# EasyEDA Pro project ProPrj_PocketEPD_2025-11-28.epro

# Schematic Main_Schematic
Board Name: PockEINK; Create Date: 2025-10-21; Page Name: P1; Project Name: PocketEPD; Schematic Name: Main_Schematic; Update Date: 2025-11-20; Company: AtomicBool; Page Size: A4; Version: V1.0
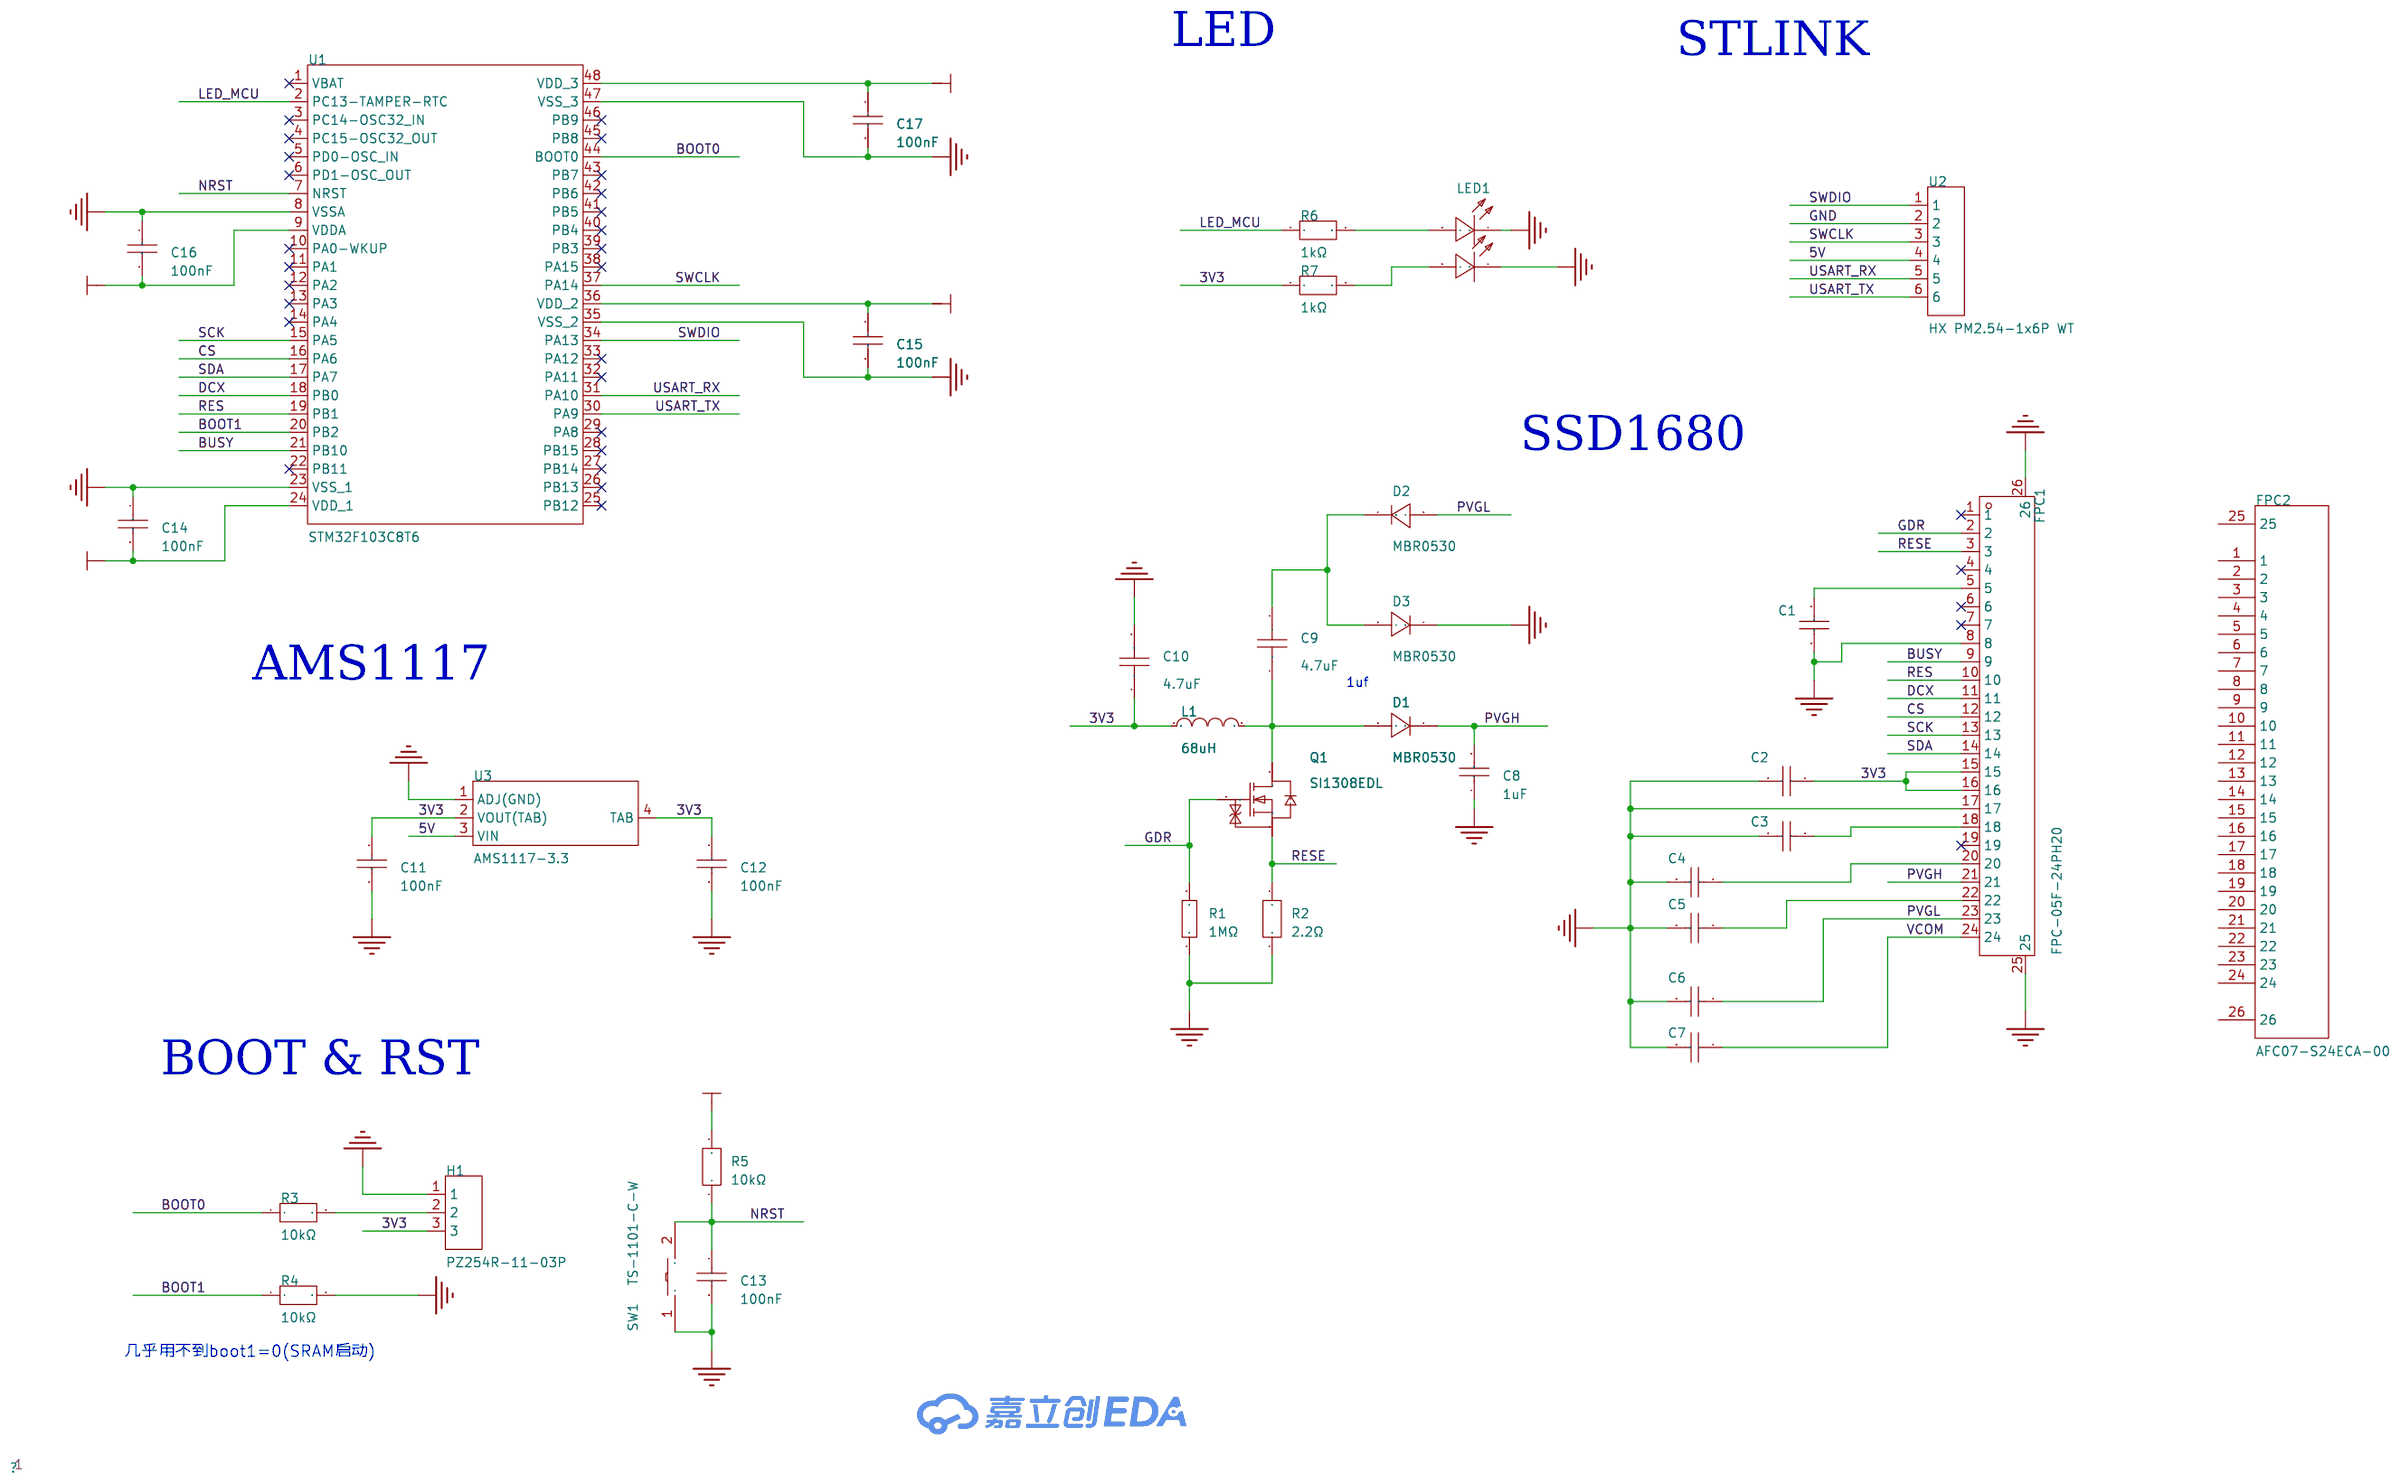
[diagram p0: schematic sheet]

## Parts
C1  1uF  [C1206]
C2  1uF  [C1206]
C3  1uF  [C1206]
C4  1uF  [C1206]
C5  1uF  [C1206]
C6  1uF  [C1206]
C7  1uF  [C1206]
C8  1uF  [C1206]
C9  4.7uF  [C1206]
C10  4.7uF  [C1206]
C11  100nF  [C1206]
C12  100nF  [C1206]
C13  100nF  [C1206]
C14  100nF  [C1206]
C15  100nF  [C1206]
C16  100nF  [C1206]
C17  100nF  [C1206]
D1  MBR0530  [SOD-123_L2.8-W1.8-LS3.7-RD]
D2  MBR0530  [SOD-123_L2.8-W1.8-LS3.7-RD]
D3  MBR0530  [SOD-123_L2.8-W1.8-LS3.7-RD]
FPC1  FPC-05F-24PH20  [FPC-SMD_24P-P0.50_FPC-05F-24PH20]
FPC2  AFC07-S24ECA-00  [FPC-SMD_AFC07-S24ECA-00]
H1  PZ254R-11-03P  [HDR-TH_3P-P2.54-H-M-W10.4]
L1  68uH  [IND-SMD_L4.0-W4.0_FNR40XXS]
LED1  TJ-S3227SW1TCGLC2R6B-A5  [LED-SMD_4P-L3.2-W2.7_PD15-22C]
Q1  SI1308EDL  [SOT-323-3_L2.0-W1.3-P1.30-LS2.1-BR]
R1  1MΩ  [R1206]
R2  2.2Ω  [R1206]
R3  10kΩ  [R1206]
R4  10kΩ  [R1206]
R5  10kΩ  [R1206]
R6  1kΩ  [R1206]
R7  1kΩ  [R1206]
SW1  TS-1101-C-W  [SW-SMD_L6.0-W3.3-LS8.0]
U1  STM32F103C8T6  [LQFP-48_L7.0-W7.0-P0.50-LS9.0-BL]
U2  HX PM2.54-1x6P WT  [HDR-SMD_6P-P2.54-H-F-W11.7]
U3  AMS1117-3.3  [SOT-223-4_L6.5-W3.5-P2.30-LS7.0-BR]

## Library data of the parts
C1-C8 = CL31B105KAHNNNE: 容值:1uF;精度:±10%;额定电压:25V;温度系数:X7R;; LCSC Part Name: 1uF ±10% 25V; Supplier Part: C28322; Manufacturer: SAMSUNG(三星); Supplier Footprint: 1206; JLCPCB Part Class: 扩展库; Datasheet: https://item.szlcsc.com/datasheet/CL31B105KAHNNNE/29073.html; Supplier: LCSC; Tolerance: ±10%; Voltage Rating: 25V; Temperature Coefficient: X7R
C9 C10 = 1206B475K250NT: 容值:4.7uF;精度:±10%;额定电压:25V;温度系数:X7R;; LCSC Part Name: 4.7uF ±10% 25V; Supplier Part: C132148; Manufacturer: FH(风华); Supplier Footprint: 1206; JLCPCB Part Class: 扩展库; Datasheet: https://item.szlcsc.com/datasheet/1206B475K250NT/143447.html; Supplier: LCSC; Tolerance: ±10%; Voltage Rating: 25V; Temperature Coefficient: X7R
C11-C17 = CL31B104KCFNNNE: 容值:100nF;精度:±10%;额定电压:100V;温度系数:X7R;; LCSC Part Name: 100nF ±10% 100V; Supplier Part: C1945; Manufacturer: SAMSUNG(三星); Supplier Footprint: 1206; JLCPCB Part Class: 扩展库; Datasheet: https://item.szlcsc.com/datasheet/CL31B104KCFNNNE/2297.html; Supplier: LCSC; Tolerance: ±10%; Voltage Rating: 100V; Temperature Coefficient: X7R
D1-D3 = MBR0530_C77336: 二极管配置:-;正向压降(Vf):550mV@500mA;直流反向耐压(Vr):30V;整流电流:500mA;; LCSC Part Name: 电压:30V 电流:500mA; Supplier Part: C77336; Manufacturer: CJ(江苏长电/长晶); Supplier Footprint: SOD-123; JLCPCB Part Class: 扩展库; Datasheet: https://item.szlcsc.com/datasheet/MBR0530/78464.html; Supplier: LCSC; Voltage - Forward(Vf@If): 550mV@500mA; Voltage - DC Reverse(Vr): 30V; Current - Rectified: 500mA; Reverse Leakage Current (Ir): 80uA@30V; Non-Repetitive Peak Forward Surge Current: 5.5A
FPC1 = FPC-05F-24PH20: 锁定特性:翻盖式;触点类型:卧贴;触点数量:24P;间距:0.5mm;安装方式:下接;工作温度:-25℃~+85℃;; LCSC Part Name: 翻盖式 卧贴 P数:24P 间距:0.5mm; Supplier Part: C2856805; Manufacturer: XUNPU(讯普); Supplier Footprint: SMD,P=0.5mm,卧贴; JLCPCB Part Class: 扩展库; Datasheet: https://item.szlcsc.com/datasheet/FPC-05F-24PH20/3056903.html; Supplier: LCSC; Locking Feature: 翻盖式; Contact Type: 卧贴; Number of Contacts: 24P; Pitch: 0.5mm; Mounting Type: 下接; FFC, FCB Thickness: 0.3mm; Height Above Board: 2mm; Contact Material: 磷青铜; Contact Plating: 锡; Operating Temperature: -25℃~+85℃; Rated Voltage (Max): 50V; Current Rating (Max): 500mA
FPC2 = AFC07-S24ECA-00: 锁定特性:抽屉式;触点类型:上接;触点数量:24P;间距:0.5mm;安装类型:卧贴;; LCSC Part Name: 间距:0.5mm P数:24P 抽屉式 上接; Supplier Part: C262643; Manufacturer: JS(钜硕电子); Supplier Footprint: SMD,P=0.5mm,卧贴; JLCPCB Part Class: 扩展库; Datasheet: https://atta.szlcsc.com/upload/public/pdf/source/20190726/C11082_A2E7B12387019CE4314BB5199EE0FDF4.pdf; Supplier: LCSC; Locking Feature: 抽屉式; Contact Type: 上接; Number of Contacts: 24P; Pitch: 0.5mm; Mounting Type: 卧贴; FFC, FCB Thickness: 0.3mm; Height Above Board: 2mm
H1 = PZ254R-11-03P: 插针结构:1x3P;间距:2.54mm;行距:-;圆针/方针:方针;安装方式:弯插;排数:单排;总PIN位数:3P;额定电流:-;额定电压:-;配合针长度:6mm;塑高:2.5mm;触头材质:黄铜;触头镀层:-;工作温度:-40℃~+105℃;颜色:黑色;; LCSC Part Name: 1x3P 间距:2.54mm 方针 弯插; Supplier Part: C492411; Manufacturer: XFCN(兴飞); Supplier Footprint: 弯插,P=2.54mm; JLCPCB Part Class: 扩展库; Datasheet: https://item.szlcsc.com/datasheet/PZ254R-11-03P/502967.html; Supplier: LCSC; Pin Structure: 1x3P; Pitch: 2.54mm; Circluar Pins/Square Pins: 方针; Mounting Type: 弯插; Number of Rows: 单排; Number of Pins: 3P; Length of Mating Pin: 6mm; Insulation Height: 2.5mm; Contact Material: 黄铜; Operating Temperature: -40℃~+105℃; Color: 黑色
L1 = FNR4020S680MT: 电感值:68uH;精度:±20%;额定电流:500mA;饱和电流(Isat):670mA;类型:磁胶屏蔽绕线合金电感;; LCSC Part Name: 68uH ±20% 670mA; Supplier Part: C167847; Manufacturer: cjiang(长江微电); Supplier Footprint: SMD,4x4mm; JLCPCB Part Class: 扩展库; Datasheet: https://atta.szlcsc.com/upload/public/pdf/source/20190327/C167925_9EFF0AABC4CA629C2CC95961DBF7D39D.pdf; Supplier: LCSC; Tolerance: ±20%; Current Rating: 500mA; Current - Saturation(Isat): 670mA; DC Resistance(DCR): 1.38Ω; Type: 磁胶屏蔽绕线合金电感
LED1 = TJ-S3227SW1TCGLC2R6B-A5: 发光颜色:红色,蓝色;正向压降(Vf):1.8V~2.4V；2.8V~3.4V;功率:108mW；72mW;正向电流:20mA;波长:620nm~630nm；460nm~470nm;二极管配置:-;透镜颜色:无色透明透镜;色温:-;发光强度:200mcd;发光角度:120°;载带方式:-;工作温度:-40℃~+80℃;; LCSC Part Name: 红灯,蓝灯; Supplier Part: C601676; Manufacturer: TOGIALED(统佳); Supplier Footprint: 1210; JLCPCB Part Class: 扩展库; Datasheet: https://item.szlcsc.com/datasheet/TJ-S3227SW1TCGLC2R6B-A5/631034.html; Supplier: LCSC; Illumination Color: 红色,蓝色; Voltage - Forward(Vf): 1.8V~2.4V；2.8V~3.4V; Power(Watts): 108mW；72mW; Forward Current: 20mA; Wavelength - Dominant: 620nm~630nm；460nm~470nm; Peak Wavelength: 460nm；630nm; Lens Color: 无色透明透镜; Luminous Intensity: 200mcd; Viewing Angle: 120°; Operating Temperature: -40℃~+80℃
Q1 = SI1308EDL: 漏源电压(Vdss):30V;连续漏极电流(Id):1.4A;导通电阻(RDS(on)):150mΩ@4.5V,0.5A;耗散功率(Pd):360mW;阈值电压(Vgs(th)):1.5V;; LCSC Part Name: 耐压:30V 电流:1.4A; Supplier Part: C7603347; Manufacturer: TECH PUBLIC(台舟); Supplier Footprint: SOT-323; JLCPCB Part Class: 扩展库; Datasheet: https://item.szlcsc.com/datasheet/SI1308EDL/8728853.html; Supplier: LCSC; Drain to Source Voltage: 30V; Current - Continuous Drain(Id): 1.4A; RDS(on): 150mΩ@4.5V,0.5A; Pd - Power Dissipation: 360mW; Gate Threshold Voltage (Vgs(th)): 1.5V; Input Capacitance(Ciss): 146pF@15V; Reverse Transfer Capacitance (Crss@Vds): 14.8pF@15V; Operating Temperature: -55℃~+150℃
R1 = FRC1206J105 TS: 电阻类型:厚膜电阻;阻值:1MΩ;精度:±5%;功率:250mW;工作电压:200V;温度系数:±100ppm/℃;; LCSC Part Name: 1MΩ ±5% 250mW 厚膜电阻; Supplier Part: C2907441; Manufacturer: FOJAN(富捷); Supplier Footprint: 1206; JLCPCB Part Class: 扩展库; Supplier: LCSC; Type: 厚膜电阻; Tolerance: ±5%; Power(Watts): 250mW; Voltage-Supply(Max): 200V; Temperature Coefficient: ±100ppm/℃; Operating Temperature: -55℃~+155℃
R2 = FRC1206J2R2 TS: 电阻类型:厚膜电阻;阻值:2.2Ω;精度:±5%;功率:250mW;工作电压:200V;温度系数:±200ppm/℃;; LCSC Part Name: 2.2Ω ±5% 250mW 厚膜电阻; Supplier Part: C2907445; Manufacturer: FOJAN(富捷); Supplier Footprint: 1206; JLCPCB Part Class: 扩展库; Supplier: LCSC; Type: 厚膜电阻; Tolerance: ±5%; Power(Watts): 250mW; Voltage-Supply(Max): 200V; Temperature Coefficient: ±200ppm/℃; Operating Temperature: -55℃~+155℃
R3-R5 = FRC1206J103 TS: 电阻类型:厚膜电阻;阻值:10kΩ;精度:±5%;功率:250mW;工作电压:200V;温度系数:±100ppm/℃;; LCSC Part Name: 10kΩ ±5% 250mW 厚膜电阻; Supplier Part: C2907423; Manufacturer: FOJAN(富捷); Supplier Footprint: 1206; JLCPCB Part Class: 扩展库; Supplier: LCSC; Type: 厚膜电阻; Tolerance: ±5%; Power(Watts): 250mW; Voltage-Supply(Max): 200V; Temperature Coefficient: ±100ppm/℃; Operating Temperature: -55℃~+155℃
R6 R7 = FRC1206J102 TS: 电阻类型:厚膜电阻;阻值:1kΩ;精度:±5%;功率:250mW;工作电压:200V;温度系数:±100ppm/℃;; LCSC Part Name: 1kΩ ±5% 250mW 厚膜电阻; Supplier Part: C2907440; Manufacturer: FOJAN(富捷); Supplier Footprint: 1206; JLCPCB Part Class: 扩展库; Supplier: LCSC; Type: 厚膜电阻; Tolerance: ±5%; Power(Watts): 250mW; Voltage-Supply(Max): 200V; Temperature Coefficient: ±100ppm/℃; Operating Temperature: -55℃~+155℃
SW1 = TS-1101-C-W: 电路结构:单刀单掷;按钮形状:矩形按钮;作用力:260gf;安装方式:立贴;开关长度:6mm;开关宽度:3.6mm;开关高度:2.5mm;带支架:不带;触点电流:50mA;额定电压(AC):-;额定电压(DC):12V;额定功率:-;绝缘电阻:-;带灯:无;机械寿命:5万次;; LCSC Part Name: 6*3.6*2.5mm 立贴 轻触开关; Supplier Part: C318938; Manufacturer: XKB Connectivity(中国星坤); Supplier Footprint: SMD; JLCPCB Part Class: 扩展库; Datasheet: https://atta.szlcsc.com/upload/public/pdf/source/20200227/C318938_C2E53B1EEDE37D980A33616AC086DE53.pdf; Supplier: LCSC; Circuit: 单刀单掷; Actuator Style: 矩形按钮; Operating Force: 260gf; Mounting Style: 立贴; Switch Length: 6mm; Switch Width: 3.6mm; Switch Height: 2.5mm; Strike Gundam: 不带; Contact Current: 50mA; Voltage Rating (DC): 12V; Actuator/Cap Color: 白色带淡绿; With Lamp: 无; Mechanical Life: 5万次; Operating Temperature: -30℃~+85℃
U1 = STM32F103C8T6: CPU内核:ARM-M3;CPU最大主频:72MHz;应用领域:-;; LCSC Part Name: 主流增强型ARM Cortex-M3 MCU，具有64 KB Flash、72 MHz CPU、电机控制、USB和CAN; Supplier Part: C8734; Manufacturer: ST(意法半导体); Supplier Footprint: LQFP-48(7x7); JLCPCB Part Class: 扩展库; Datasheet: https://item.szlcsc.com/datasheet/STM32F103C8T6/9243.html; Supplier: LCSC; CPU Core: ARM-M3; CPU Maximum Speed: 72MHz; Program Storage Size: 64KB; Program Memory Type: FLASH; Number of I/O: 37; ADC (Bit): 12bit; Voltage - Supply: 2V~3.6V
U2 = HX PM2.54-1x6P WT: 插孔结构:1x6P;间距:2.54mm;行距:-;圆孔/方孔:方孔;安装方式:卧贴;排数:单排;总孔位数:6P;额定电流:3A;额定电压:1kV;插孔方向:顶部;塑高:8.5mm;触头材质:黄铜;触头镀层:金;工作温度:-40℃~+105℃;; LCSC Part Name: 配套排针：HX PZ2.54-1x6P系列 1x6P 间距:2.54mm 卧贴; Supplier Part: C46061770; Manufacturer: hanxia(韩下); Supplier Footprint: SMD,P=2.54mm,卧贴; Datasheet: https://item.szlcsc.com/datasheet/HX%2520PM2.54-1x6P%2520WT/48170630.html; Supplier: LCSC; Holes Structure: 1x6P; Pitch: 2.54mm; Circular Hole / Square Hole: 方孔; Mounting Type: 卧贴; Number of Rows: 单排; Number of Positions: 6P; Current Rating: 3A; Voltage Rating (Max): 1kV; Holes Direction: 顶部; Insulation Height: 8.5mm; Contact Material: 黄铜; Contact Plating: 金; Operating Temperature: -40℃~+105℃; PIN Length: 3.2mm
U3 = AMS1117-3.3_C347222: 输出类型:固定;工作电压:12V;输出电压:3.3V;输出电流:1A;电源纹波抑制比(PSRR):60dB@(120Hz);输出极性:正极;; LCSC Part Name: 输出:3.3V 电流:1A 耐压:12V; Supplier Part: C347222; Manufacturer: UMW(友台半导体); Supplier Footprint: SOT-223; JLCPCB Part Class: 扩展库; Datasheet: https://item.szlcsc.com/datasheet/AMS1117-3.3/323882.html; Supplier: LCSC; Output Type: 固定; Voltage - Supply: 12V; Output Voltage: 3.3V; Output Current: 1A; Power Supply Rejection Ratio (PSRR): 60dB@(120Hz); Voltage Dropout: 1.3V@(1A); Features: 过流保护; Output Configuration: 正极; Number of Outputs: 1

## Nets
3V3: C2.1 C10.1 C11.2 C12.2 C14.2 C15.2 C16.2 C17.1 FPC1.15 FPC1.16 H1.3 L1.1 R5.2 R7.1 U1.9(VDDA) U1.24(VDD_1) U1.36(VDD_2) U1.48(VDD_3) U3.2(VOUT(TAB)) U3.4(TAB)
5V: U2.4 U3.3(VIN)
GND: C1.1 C2.2 C3.2 C4.2 C5.2 C6.2 C7.2 C8.1 C10.2 C11.1 C12.1 C13.2 C14.1 C15.1 C16.1 C17.2 D3.1(C) FPC1.8 FPC1.17 FPC1.25 FPC1.26 H1.1 LED1.1(C) LED1.4(C) R1.1 R2.1 R4.2 SW1.1 U1.8(VSSA) U1.23(VSS_1) U1.35(VSS_2) U1.47(VSS_3) U2.2 U3.1(ADJ(GND))
BOOT0: R3.1 U1.44(BOOT0)
BOOT1: R4.1 U1.20(PB2)
BUSY: FPC1.9 U1.21(PB10)
CS: FPC1.12 U1.16(PA6)
DCX: FPC1.11 U1.18(PB0)
GDR: FPC1.2 Q1.1(G) R1.2
LED_MCU: R6.1 U1.2(PC13-TAMPER-RTC)
NRST: C13.1 R5.1 SW1.2 U1.7(NRST)
PVGH: C8.2 D1.1(C) FPC1.21
PVGL: C6.1 D2.2(A) FPC1.23
RES: FPC1.10 U1.19(PB1)
RESE: FPC1.3 Q1.2(S) R2.2
SCK: FPC1.13 U1.15(PA5)
SDA: FPC1.14 U1.17(PA7)
SWCLK: U1.37(PA14) U2.3
SWDIO: U1.34(PA13) U2.1
USART_RX: U1.31(PA10) U2.5
USART_TX: U1.30(PA9) U2.6
VCOM: C7.1 FPC1.24
$1N1465: C1.2 FPC1.5
$1N1584: C3.1 FPC1.18
$1N1618: C4.1 FPC1.20
$1N1662: C5.1 FPC1.22
$1N1889: C9.2 D2.1(C) D3.2(A)
$1N2921: C9.1 D1.2(A) L1.2 Q1.3(D)
$1N4223: H1.2 R3.2
$1N6080: LED1.2(A) R7.2
$1N6084: LED1.3(A) R6.2

Not connected (* = marked no-connect by the designer): FPC1 1* 4* 6* 7* 19*; FPC2 1 2 3 4 5 6 7 8 9 10 11 12 13 14 15 16 17 18 19 20 21 22 23 24 25 26; U1 1(VBAT)* 3(PC14-OSC32_IN)* 4(PC15-OSC32_OUT)* 5(PD0-OSC_IN)* 6(PD1-OSC_OUT)* 10(PA0-WKUP)* 11(PA1)* 12(PA2)* 13(PA3)* 14(PA4)* 22(PB11)* 25(PB12)* 26(PB13)* 27(PB14)* 28(PB15)* 29(PA8)* 32(PA11)* 33(PA12)* 38(PA15)* 39(PB3)* 40(PB4)* 41(PB5)* 42(PB6)* 43(PB7)* 45(PB8)* 46(PB9)*

## Notes on the sheet
- LED
- STLINK
- SSD1680
- AMS1117
- 1uf
- BOOT & RST
- 几乎用不到boot1=0(SRAM启动)

# Board Main_PCB
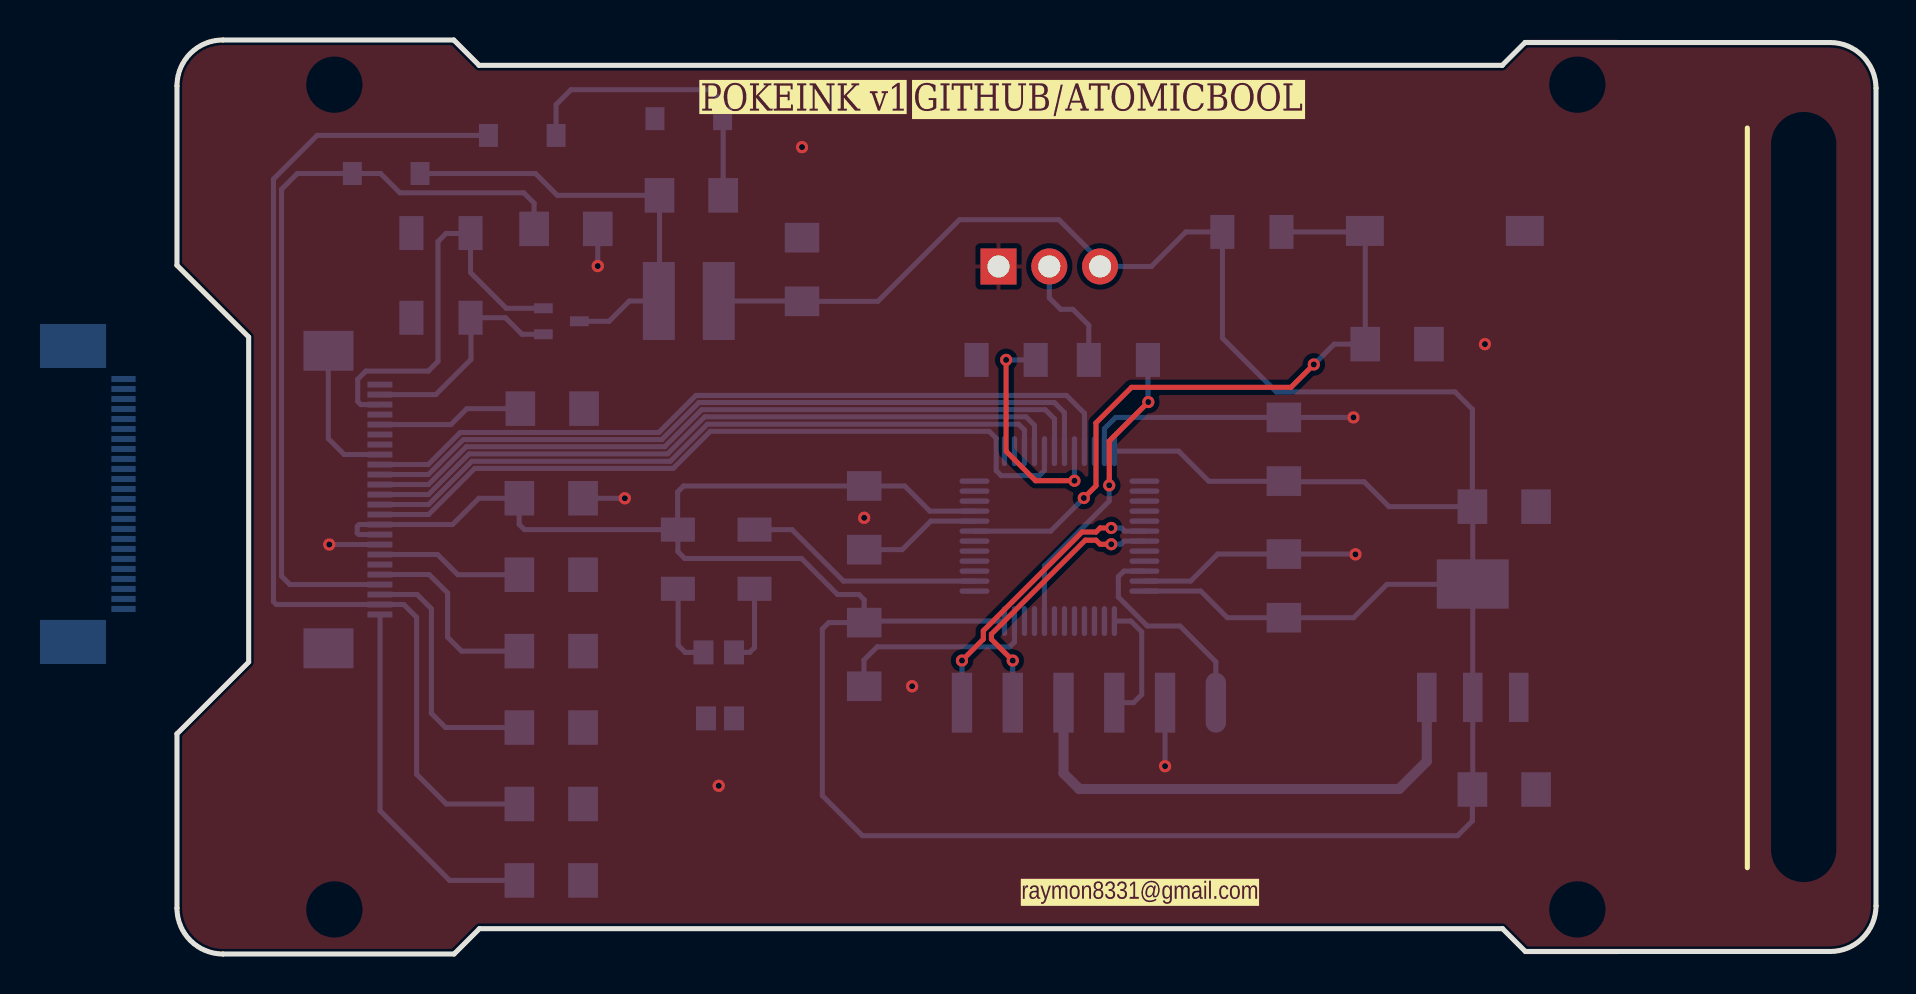
[diagram p1: board, top side]
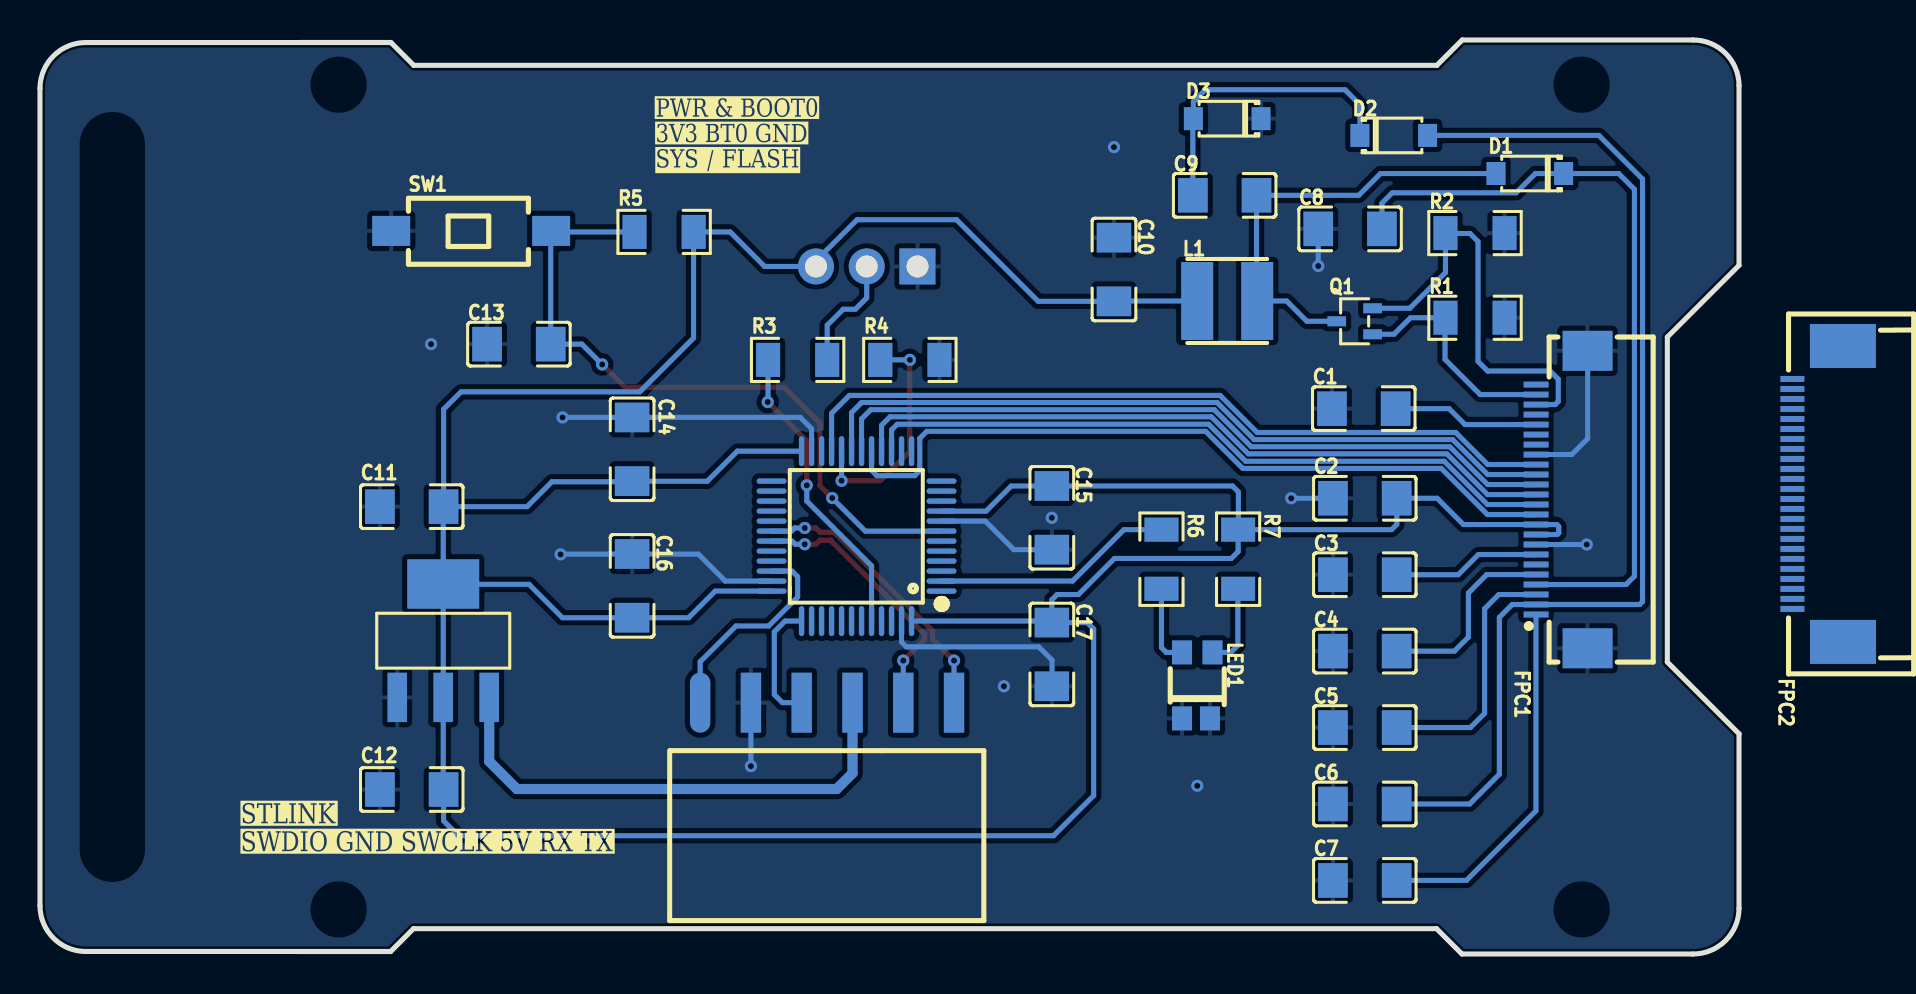
[diagram p2: board, bottom side, seen from below]

Outline 84.99 x 45.72 mm; copper layers: Top Layer, Bottom Layer. Coordinates in mm from the lower left corner of the outline.
Outline path: 0,43.43 arc(0.68,45.05) 2.3,45.72 13.84,45.72 15.11,44.45 66.29,44.45 67.44,45.59 76.83,45.59 82.68,45.59 arc(84.31,44.93) 84.99,43.31 84.99,2.41 arc(84.32,0.79) 82.69,0.13 76.84,0.13 67.45,0.13 66.31,1.27 15.13,1.27 13.86,0 2.32,0 arc(0.68,0.66) 0,2.28 0,11.02 3.59,14.6 3.59,30.86 0,34.45 0,43.43
Stack: Top Layer 0.035mm / Dielectric1 1.51mm FR4 er 4.5 / Bottom Layer 0.035mm

## Design rules (mm)
net USART_TX: USART1
net USART_RX: USART1
net SWDIO: STLINK
net SWCLK: STLINK
template: 自定义配置
spacing copperThickness1oz (default): track to track 0.102, other pairs 0.152 to 0.3
spacing copperThickness2oz: track to track 0.203, other pairs 0.152 to 0.3
track width copperThickness1oz (default): min 0.127, default 0.254, max 2.54
track width copperThickness2oz: min 0.203, default 0.254, max 2.54
differential pair differentialPair (default): width min 0.127, default 0.254, max 2.54; gap min 0.152, default 0.152
via viaSize (default): diameter min 0.5, default 0.61, max 10; hole min 0.3, default 0.305, max 6.3

## Placement (name value [footprint] x y rotation side)
C1  1uF  [C1206]  18.77 27.28 180 bottom
C2  1uF  [C1206]  18.72 22.8 0 bottom
C3  1uF  [C1206]  18.72 18.97 0 bottom
C4  1uF  [C1206]  18.72 15.15 0 bottom
C5  1uF  [C1206]  18.72 11.33 0 bottom
C6  1uF  [C1206]  18.72 7.5 0 bottom
C7  1uF  [C1206]  18.72 3.68 0 bottom
C8  1uF  [C1206]  19.46 36.27 180 bottom
C9  4.7uF  [C1206]  25.73 37.95 0 bottom
C10  4.7uF  [C1206]  31.27 34.24 90 bottom
C11  100nF  [C1206]  66.4 22.38 180 bottom
C12  100nF  [C1206]  66.4 8.23 180 bottom
C13  100nF  [C1206]  61.04 30.5 0 bottom
C14  100nF  [C1206]  55.37 25.25 270 bottom
C15  100nF  [C1206]  34.38 21.82 90 bottom
C16  100nF  [C1206]  55.37 18.41 270 bottom
C17  100nF  [C1206]  34.38 14.98 270 bottom
D1  MBR0530  [SOD-123_L2.8-W1.8-LS3.7-RD]  10.47 39.04 0 bottom
D2  MBR0530  [SOD-123_L2.8-W1.8-LS3.7-RD]  17.27 40.94 180 bottom
D3  MBR0530  [SOD-123_L2.8-W1.8-LS3.7-RD]  25.6 41.78 0 bottom
FPC1  FPC-05F-24PH20  [FPC-SMD_24P-P0.50_FPC-05F-24PH20]  8.86 22.73 90 bottom
FPC2  AFC07-S24ECA-00  [FPC-SMD_AFC07-S24ECA-00]  -3.94 23.01 90 bottom
H1  PZ254R-11-03P  [HDR-TH_3P-P2.54-H-M-W10.4]  43.64 34.39 0 bottom
L1  68uH  [IND-SMD_L4.0-W4.0_FNR40XXS]  25.6 32.66 180 bottom
LED1  TJ-S3227SW1TCGLC2R6B-A5  [LED-SMD_4P-L3.2-W2.7_PD15-22C]  27.1 13.44 90 bottom
Q1  SI1308EDL  [SOT-323-3_L2.0-W1.3-P1.30-LS2.1-BR]  19.23 31.65 180 bottom
R1  1MΩ  [R1206]  13.21 31.82 0 bottom
R2  2.2Ω  [R1206]  13.21 36.06 0 bottom
R3  10kΩ  [R1206]  47.09 29.72 180 bottom
R4  10kΩ  [R1206]  41.48 29.72 180 bottom
R5  10kΩ  [R1206]  53.77 36.12 180 bottom
R6  1kΩ  [R1206]  28.89 19.75 270 bottom
R7  1kΩ  [R1206]  25.06 19.75 270 bottom
SW1  TS-1101-C-W  [SW-SMD_L6.0-W3.3-LS8.0]  63.42 36.17 180 bottom
U1  STM32F103C8T6  [LQFP-48_L7.0-W7.0-P0.50-LS9.0-BL]  44.15 20.9 90 bottom
U2  HX PM2.54-1x6P WT  [HDR-SMD_6P-P2.54-H-F-W11.7]  45.62 12.57 180 bottom
U3  AMS1117-3.3  [SOT-223-4_L6.5-W3.5-P2.30-LS7.0-BR]  64.82 15.67 270 bottom

## Footprints (pads in the part's own frame, mm; a bottom-side part is the same pattern mirrored in y, then rotated)
C1206
  rect 1.485x1.728 smd: 1(-1.593,0) 2(1.593,0)
FPC-SMD_24P-P0.50_FPC-05F-24PH20
  rect 0.3x1.25 smd: 1(5.75,1.288) 2(5.25,1.288) 3(4.75,1.288) 4(4.25,1.288) 5(3.75,1.288) 6(3.25,1.288) 7(2.75,1.288) 8(2.25,1.288) 9(1.75,1.288) 10(1.25,1.288) 11(0.75,1.288) 12(0.25,1.288) 13(-0.25,1.288) 14(-0.75,1.288) 15(-1.25,1.288) 16(-1.75,1.288) 17(-2.25,1.288) 18(-2.75,1.288) 19(-3.25,1.288) 20(-3.75,1.288) 21(-4.25,1.288) 22(-4.75,1.288) 23(-5.25,1.288) 24(-5.75,1.288)
  rect 2x2.5 smd: 25(7.44,-1.288) 26(-7.44,-1.288)
FPC-SMD_AFC07-S24ECA-00
  rect 0.3x1.2 smd: 1(5.75,1.266) 2(5.251,1.266) 3(4.75,1.266) 4(4.25,1.266) 5(3.749,1.266) 6(3.249,1.266) 7(2.749,1.266) 8(2.25,1.266) 9(1.75,1.266) 10(1.25,1.266) 11(0.75,1.266) 12(0.249,1.266) 13(-0.251,1.266) 14(-0.75,1.266) 15(-1.25,1.266) 16(-1.75,1.266) 17(-2.25,1.266) 18(-2.75,1.266) 19(-3.251,1.266) 20(-3.751,1.266) 21(-4.252,1.266) 22(-4.749,1.266) 23(-5.25,1.266) 24(-5.75,1.266)
  rect 2.2x3.3 smd: 25(-7.401,-1.266) 26(7.401,-1.26)
HDR-SMD_6P-P2.54-H-F-W11.7
  oval 1.02x3 smd: 1(-6.35,0)
  rect 1.02x3 smd: 2(-3.81,0) 3(-1.27,0) 4(1.27,0) 5(3.81,0) 6(6.35,0)
HDR-TH_3P-P2.54-H-M-W10.4
  rect 1.8x1.8 hole 1.1: 1(-2.54,0)
  round 1.8 hole 1.1: 2(0,0) 3(2.54,0)
IND-SMD_L4.0-W4.0_FNR40XXS
  rect 1.6x3.9 smd: 1(-1.5,0) 2(1.5,0)
LED-SMD_4P-L3.2-W2.7_PD15-22C
  rect 1.2x1 smd: 1(-1.65,-0.636) 2(1.65,-0.763) 3(1.65,0.763) 4(-1.65,0.763)
LQFP-48_L7.0-W7.0-P0.50-LS9.0-BL
  oval 0.27x1.5 smd: 1(-2.75,-4.25) 2(-2.25,-4.25) 3(-1.75,-4.25) 4(-1.25,-4.25) 5(-0.75,-4.25) 6(-0.25,-4.25) 7(0.25,-4.25) 8(0.75,-4.25) 9(1.25,-4.25) 10(1.75,-4.25) 11(2.25,-4.25) 12(2.75,-4.25) 25(2.75,4.25) 26(2.25,4.25) 27(1.75,4.25) 28(1.25,4.25) 29(0.75,4.25) 30(0.25,4.25) 31(-0.25,4.25) 32(-0.75,4.25) 33(-1.25,4.25) 34(-1.75,4.25) 35(-2.25,4.25) 36(-2.75,4.25)
  oval 1.5x0.27 smd: 13(4.25,-2.75) 14(4.25,-2.25) 15(4.25,-1.75) 16(4.25,-1.25) 17(4.25,-0.75) 18(4.25,-0.25) 19(4.25,0.25) 20(4.25,0.75) 21(4.25,1.25) 22(4.25,1.75) 23(4.25,2.25) 24(4.25,2.75) 37(-4.25,2.75) 38(-4.25,2.25) 39(-4.25,1.75) 40(-4.25,1.25) 41(-4.25,0.75) 42(-4.25,0.25) 43(-4.25,-0.25) 44(-4.25,-0.75) 45(-4.25,-1.25) 46(-4.25,-1.75) 47(-4.25,-2.25) 48(-4.25,-2.75)
R1206
  rect 1.208x1.701 smd: 1(-1.479,0) 2(1.479,0)
SOD-123_L2.8-W1.8-LS3.7-RD
  rect 0.95x1.15 smd: 1(-1.692,0) 2(1.692,0)
SOT-223-4_L6.5-W3.5-P2.30-LS7.0-BR
  rect 2.47x0.98 smd: 1(2.835,-2.3) 2(2.835,0) 3(2.835,2.3)
  rect 2.47x3.6 smd: 4(-2.835,0)
SOT-323-3_L2.0-W1.3-P1.30-LS2.1-BR
  rect 0.936x0.5 smd: 1(0.898,-0.65) 2(0.898,0.65) 3(-0.898,0)
SW-SMD_L6.0-W3.3-LS8.0
  rect 1.9x1.5 smd: 1(-4,0) 2(4,0)

## Nets
As in the schematic.

Pads without a net: FPC1 1 4 6 7 19; FPC2 1 2 3 4 5 6 7 8 9 10 11 12 13 14 15 16 17 18 19 20 21 22 23 24 25 26; U1 1 3 4 5 6 10 11 12 13 14 22 25 26 27 28 29 32 33 38 39 40 41 42 43 45 46

## Via types
v1: diameter 0.61, hole 0.305, Top Layer to Bottom Layer, 21 vias

## Routing (per net, layer and track width the routed paths; a pad name or vN(x,y) marks a point on that pad's centre or on a via; arc(x,y) is an arc through that point)
3V3: length 206.1
  Bottom Layer w0.254: C17.1 34.38,17.72 34.11,17.98 33.05,17.98 31.24,19.79 25.4,19.79 25.06,20.13 R7.1 ; C17.1 34.45,16.65 U1.48 ; C17.1 32.61,16.58 32.28,16.25 32.28,7.92 34.29,5.92 64.06,5.92 64.8,6.66 C12.2 64.82,8.25 U3.2 U3.4 ; C11.2 60.63,22.38 59.38,23.62 55.41,23.62 C14.2 55.36,23.65 51.61,23.65 50.11,25.15 U1.24 ; C11.2 64.82,22.36 U3.4 ; C11.2 64.8,27.25 63.93,28.12 54.99,28.12 52.3,30.81 52.3,36.11 R5.2 50.47,36.12 48.74,34.39 H1.3 46.18,34.67 44.12,36.73 39.14,36.73 35.06,32.65 C10.1 31.25,32.66 L1.1 ; U3.4 64.81,18.49 60.53,18.49 58.86,16.82 C16.2 52.54,16.82 51.21,18.15 U1.36 ; R7.1 25.04,21.24 25.04,23.11 25.34,23.41 C15.2 36.41,23.41 37.66,22.15 U1.9 ; R7.1 17.38,21.23 17.12,21.49 17.12,22.79 C2.1 15.1,22.8 13.79,21.48 FPC1.15 9.11,21.48 9.02,21.39 9.02,21.06 9.09,20.98 10.16,20.98
5V: length 25.8
  Bottom Layer w0.508: U2.4 44.35,9.04 45.14,8.25 61.14,8.25 62.52,9.64 U3.3
GND: length 58.3
  Bottom Layer w0.254: U1.47 41.9,15.61 41.66,15.37 35.03,15.37 34.37,14.71 34.37,13.4 C17.2 ; 10.16,24.98 8.37,24.98 7.57,25.78 7.57,30.16 7.58,30.17 ; U2.2 v1(49.43,9.4) ; v1(58.95,19.99) 58.94,20.01 C16.1 52.06,20.01 50.71,18.65 U1.35 ; C2.2 v1(22.4,22.8) ; U1.8 37.71,21.65 36.28,20.22 C15.1 ; C8.1 v1(21.05,34.41) ; 10.16,20.48 v1(7.62,20.48) ; v1(58.85,26.84) C14.1 46.96,26.84 46.4,26.28 U1.23
  vias: v1(27.1,8.41) v1(31.27,40.36) v1(34.38,21.82) v1(36.78,13.39) v1(65.43,30.5)
BOOT0: length 15.2
  Top Layer w0.254: v1(48.59,27.61) 46.63,25.65 v1(46.63,23.44)
  Bottom Layer w0.254: v1(48.59,27.61) 48.57,27.63 R3.1 ; U1.44 43.4,19.42 46.63,22.66 v1(46.63,23.44)
BOOT1: length 11.5
  Top Layer w0.254: v1(44.9,23.67) 42.95,23.67 41.48,25.14 v1(41.48,29.72)
  Bottom Layer w0.254: 42.96,29.72 41.53,29.72 ; U1.20 v1(44.9,23.67)
BUSY: length 38.9
  Bottom Layer w0.254: U1.21 45.4,27.04 44.5,27.94 25.96,27.94 24.1,26.08 14.17,26.08 12.57,24.48 10.16,24.48
CS: length 35.8
  Bottom Layer w0.254: U1.16 42.9,26.44 42.47,26.87 26.4,26.87 24.55,25.02 14.62,25.02 12.58,22.98 10.16,22.98
DCX: length 37.1
  Bottom Layer w0.254: 10.16,23.48 12.58,23.48 14.47,25.37 24.4,25.37 26.25,27.23 43.43,27.23 43.9,26.77 U1.18
GDR: length 11.4
  Bottom Layer w0.254: Q1.1 17.26,31 16.43,31.82 R1.2 14.71,31.8 14.71,29.74 12.95,27.98 10.16,27.98
LED_MCU: length 12.1
  Bottom Layer w0.254: R6.1 30.77,21.23 33.34,18.65 U1.2
NRST: length 35.1
  Top Layer w0.254: v1(45.36,22.81) 45.97,23.42 45.97,26.57 47.75,28.34 55.73,28.34 v1(56.87,29.49)
  Bottom Layer w0.254: v1(56.87,29.49) 57.89,30.5 C13.1 59.44,36.15 SW1.2 59.37,36.12 55.25,36.12 ; v1(45.36,22.81) 43.71,21.15 U1.7
PVGH: length 39.3
  Bottom Layer w0.254: 10.16,18.48 5.65,18.48 5.23,18.9 5.23,38.25 6.02,39.04 D1.1 10.19,39.04 11.15,38.07 17.35,38.07 17.86,37.56 C8.2
PVGL: length 53.9
  Bottom Layer w0.254: D2.2 7.01,40.94 4.83,38.76 4.83,17.63 4.97,17.48 FPC1.23 11.35,17.48 11.99,16.84 11.99,8.99 13.47,7.5 C6.1
RES: length 37.9
  Bottom Layer w0.254: U1.19 44.4,27.08 43.89,27.58 26.11,27.58 24.25,25.73 14.32,25.73 12.57,23.98 10.16,23.98
RESE: length 20.8
  Bottom Layer w0.254: 10.16,27.48 9.19,27.48 9.04,27.63 9.04,28.75 9.45,29.16 12.57,29.16 13.06,29.64 13.06,35.63 13.46,36.04 14.67,36.04 R2.2 14.69,34.08 16.47,32.3 Q1.2
SCK: length 35.1
  Bottom Layer w0.254: U1.15 42.4,26.21 42.1,26.5 26.53,26.5 24.68,24.65 14.75,24.65 12.58,22.48 10.16,22.48
SDA: length 37.9
  Bottom Layer w0.254: 10.16,21.98 12.59,21.98 14.9,24.29 24.83,24.29 26.68,26.14 40.63,26.14 40.98,25.79 40.98,24.18 41.24,23.93 43.13,23.93 43.4,24.19 U1.17
SWCLK: length 6.3
  Bottom Layer w0.254: U1.37 47.72,16.65 48.26,16.11 48.26,12.98 47.85,12.57 U2.3
SWDIO: length 10.7
  Bottom Layer w0.254: U2.1 51.97,14.61 50.18,16.41 48.54,16.41 47.09,17.85 47.09,18.87 47.37,19.15 U1.34
USART_RX: length 13.6
  Top Layer w0.254: v1(41.81,14.68) 40.74,15.74 40.74,16 45.44,20.7 45.97,20.7 46.18,20.5 v1(46.74,20.5)
  Bottom Layer w0.254: U1.31 47.38,20.65 47.22,20.5 v1(46.74,20.5) ; U2.5 v1(41.81,14.68)
USART_TX: length 14.3
  Top Layer w0.254: v1(39.27,14.68) 40.34,15.74 40.34,16.17 45.28,21.11 45.97,21.11 46.18,21.31 v1(46.74,21.31)
  Bottom Layer w0.254: U2.6 v1(39.27,14.68) ; U1.30 47.4,21.15 47.24,21.31 v1(46.74,21.31)
VCOM: length 18.2
  Bottom Layer w0.254: C7.1 13.64,3.68 10.16,7.16 10.16,16.98
$1N1465: length 7.3
  Bottom Layer w0.254: 10.16,26.48 13.71,26.48 14.5,27.28 C1.2
$1N1584: length 7.4
  Bottom Layer w0.254: C3.1 14.05,18.97 13.04,19.98 10.16,19.98
$1N1618: length 9.8
  Bottom Layer w0.254: C4.1 14.24,15.15 13.54,15.85 13.54,18.06 12.61,18.98 10.16,18.98
$1N1662: length 12.8
  Bottom Layer w0.254: 10.16,17.98 12.01,17.98 12.73,17.27 12.73,12.04 13.44,11.33 C5.1
$1N1889: length 15.1
  Bottom Layer w0.254: 27.32,37.95 27.32,41.75 D3.2 27.3,42.63 26.7,43.23 19.71,43.23 18.96,42.48 D2.1
$1N2921: length 22.1
  Bottom Layer w0.254: Q1.3 21.62,31.65 22.63,32.66 L1.2 24.14,32.7 C9.1 19.02,37.95 17.93,39.04 12.16,39.04
$1N4223: length 5.8
  Bottom Layer w0.254: H1.2 43.64,32.82 44.2,32.25 44.81,32.25 45.61,31.45 R3.2
$1N6080: length 4.2
  Bottom Layer w0.254: LED1.2 25.43,15.09 25.07,15.44 25.07,18.26 R7.2
$1N6084: length 4.1
  Bottom Layer w0.254: R6.2 28.89,15.33 28.65,15.09 ; 28.65,15.09 LED1.3

## Copper pours and planes (outline as drawn; the poured copper is in the pictures)
GND on Top Layer: -2.6,49.73 92.51,49.73 92.51,-1.4 -2.6,-1.4
GND on Bottom Layer: -3.87,47.35 90.06,47.35 90.06,-3.78 -3.87,-3.78

## Text on the board
Bottom Silkscreen Layer: PWR & BOOT0 | 3V3 BT0 GND | SYS / FLASH | STLINK | SWDIO GND SWCLK 5V RX TX
Top Silkscreen Layer: raymon8331@gmail.com | POKEINK v1 | GITHUB/ATOMICBOOL
